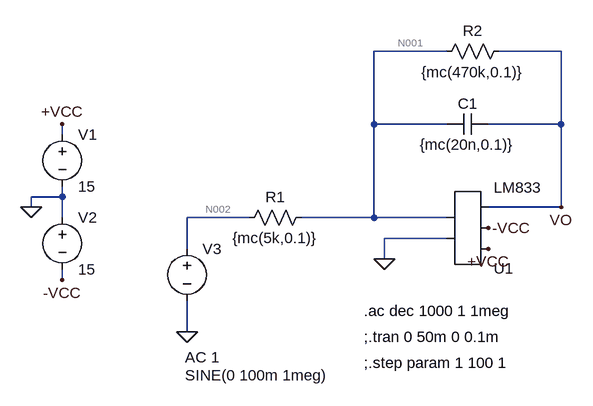
[diagram p0: schematic Integrador compensado.asc]
* Integrador compensado.asc
V1 +VCC 0 15
V2 0 -VCC 15
* U1: LM833 (symbol AutoGenerated\LM833 not available, pins judged from their places): pin1=0 pin2=N001 pin3=+VCC pin4=-VCC pin5=VO
V3 N002 0 SINE(0 100m 1meg) AC 1
C1 VO N001 {mc(20n,0.1)}
R1 N001 N002 {mc(5k,0.1)}
R2 VO N001 {mc(470k,0.1)}
.ac dec 1000 1 1meg
;.tran 0 50m 0 0.1m
;.step param 1 100 1
.backanno
.end

* Results of the author's LTspice run, read from the files saved beside the schematic
* Operating Point, zero values left out:
*   V(+vcc) = 15 V
*   V(-vcc) = -15 V
*   V(n001) = 2.499 µV
*   V(vo) = -110.1 mV
*   I(R2) = -249.5 nA
*   I(R1) = 493.5 pA
*   I(V3) = 493.5 pA
*   I(V2) = -2.383 mA
*   I(V1) = -2.383 mA
*   Ix(u1:2) = -250 nA
*   Ix(u1:1) = -250 nA
*   Ix(u1:4) = 2.383 mA
*   Ix(u1:5) = -2.383 mA
*   Ix(u1:3) = 249.5 nA
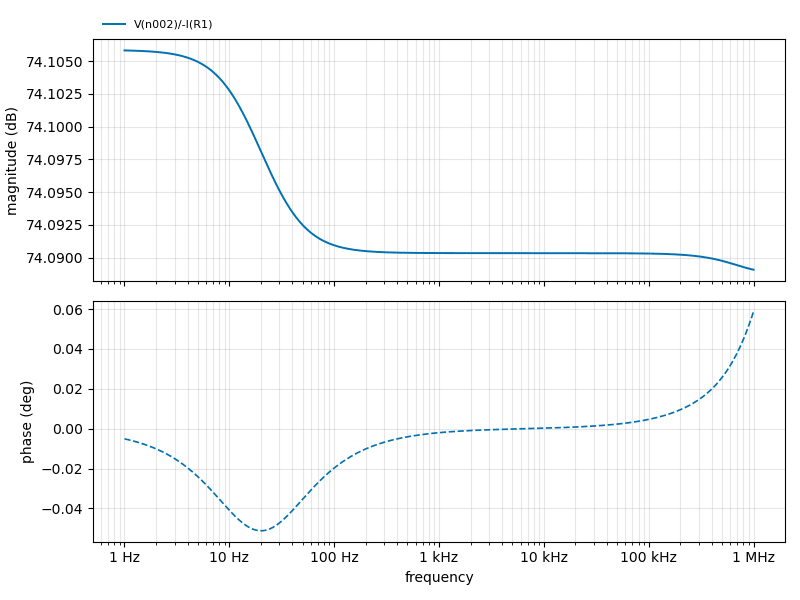
[diagram p1: AC Analysis of Integrador compensado.asc, plotted from the saved traces]
* AC Analysis, 1 run:
*   V(n002)/-I(R1): 74.11 dB at 1 Hz, 74.09 dB at 1 MHz, peak 74.11 dB at 1 Hz